# Altium project PCB_Project.PrjPcb
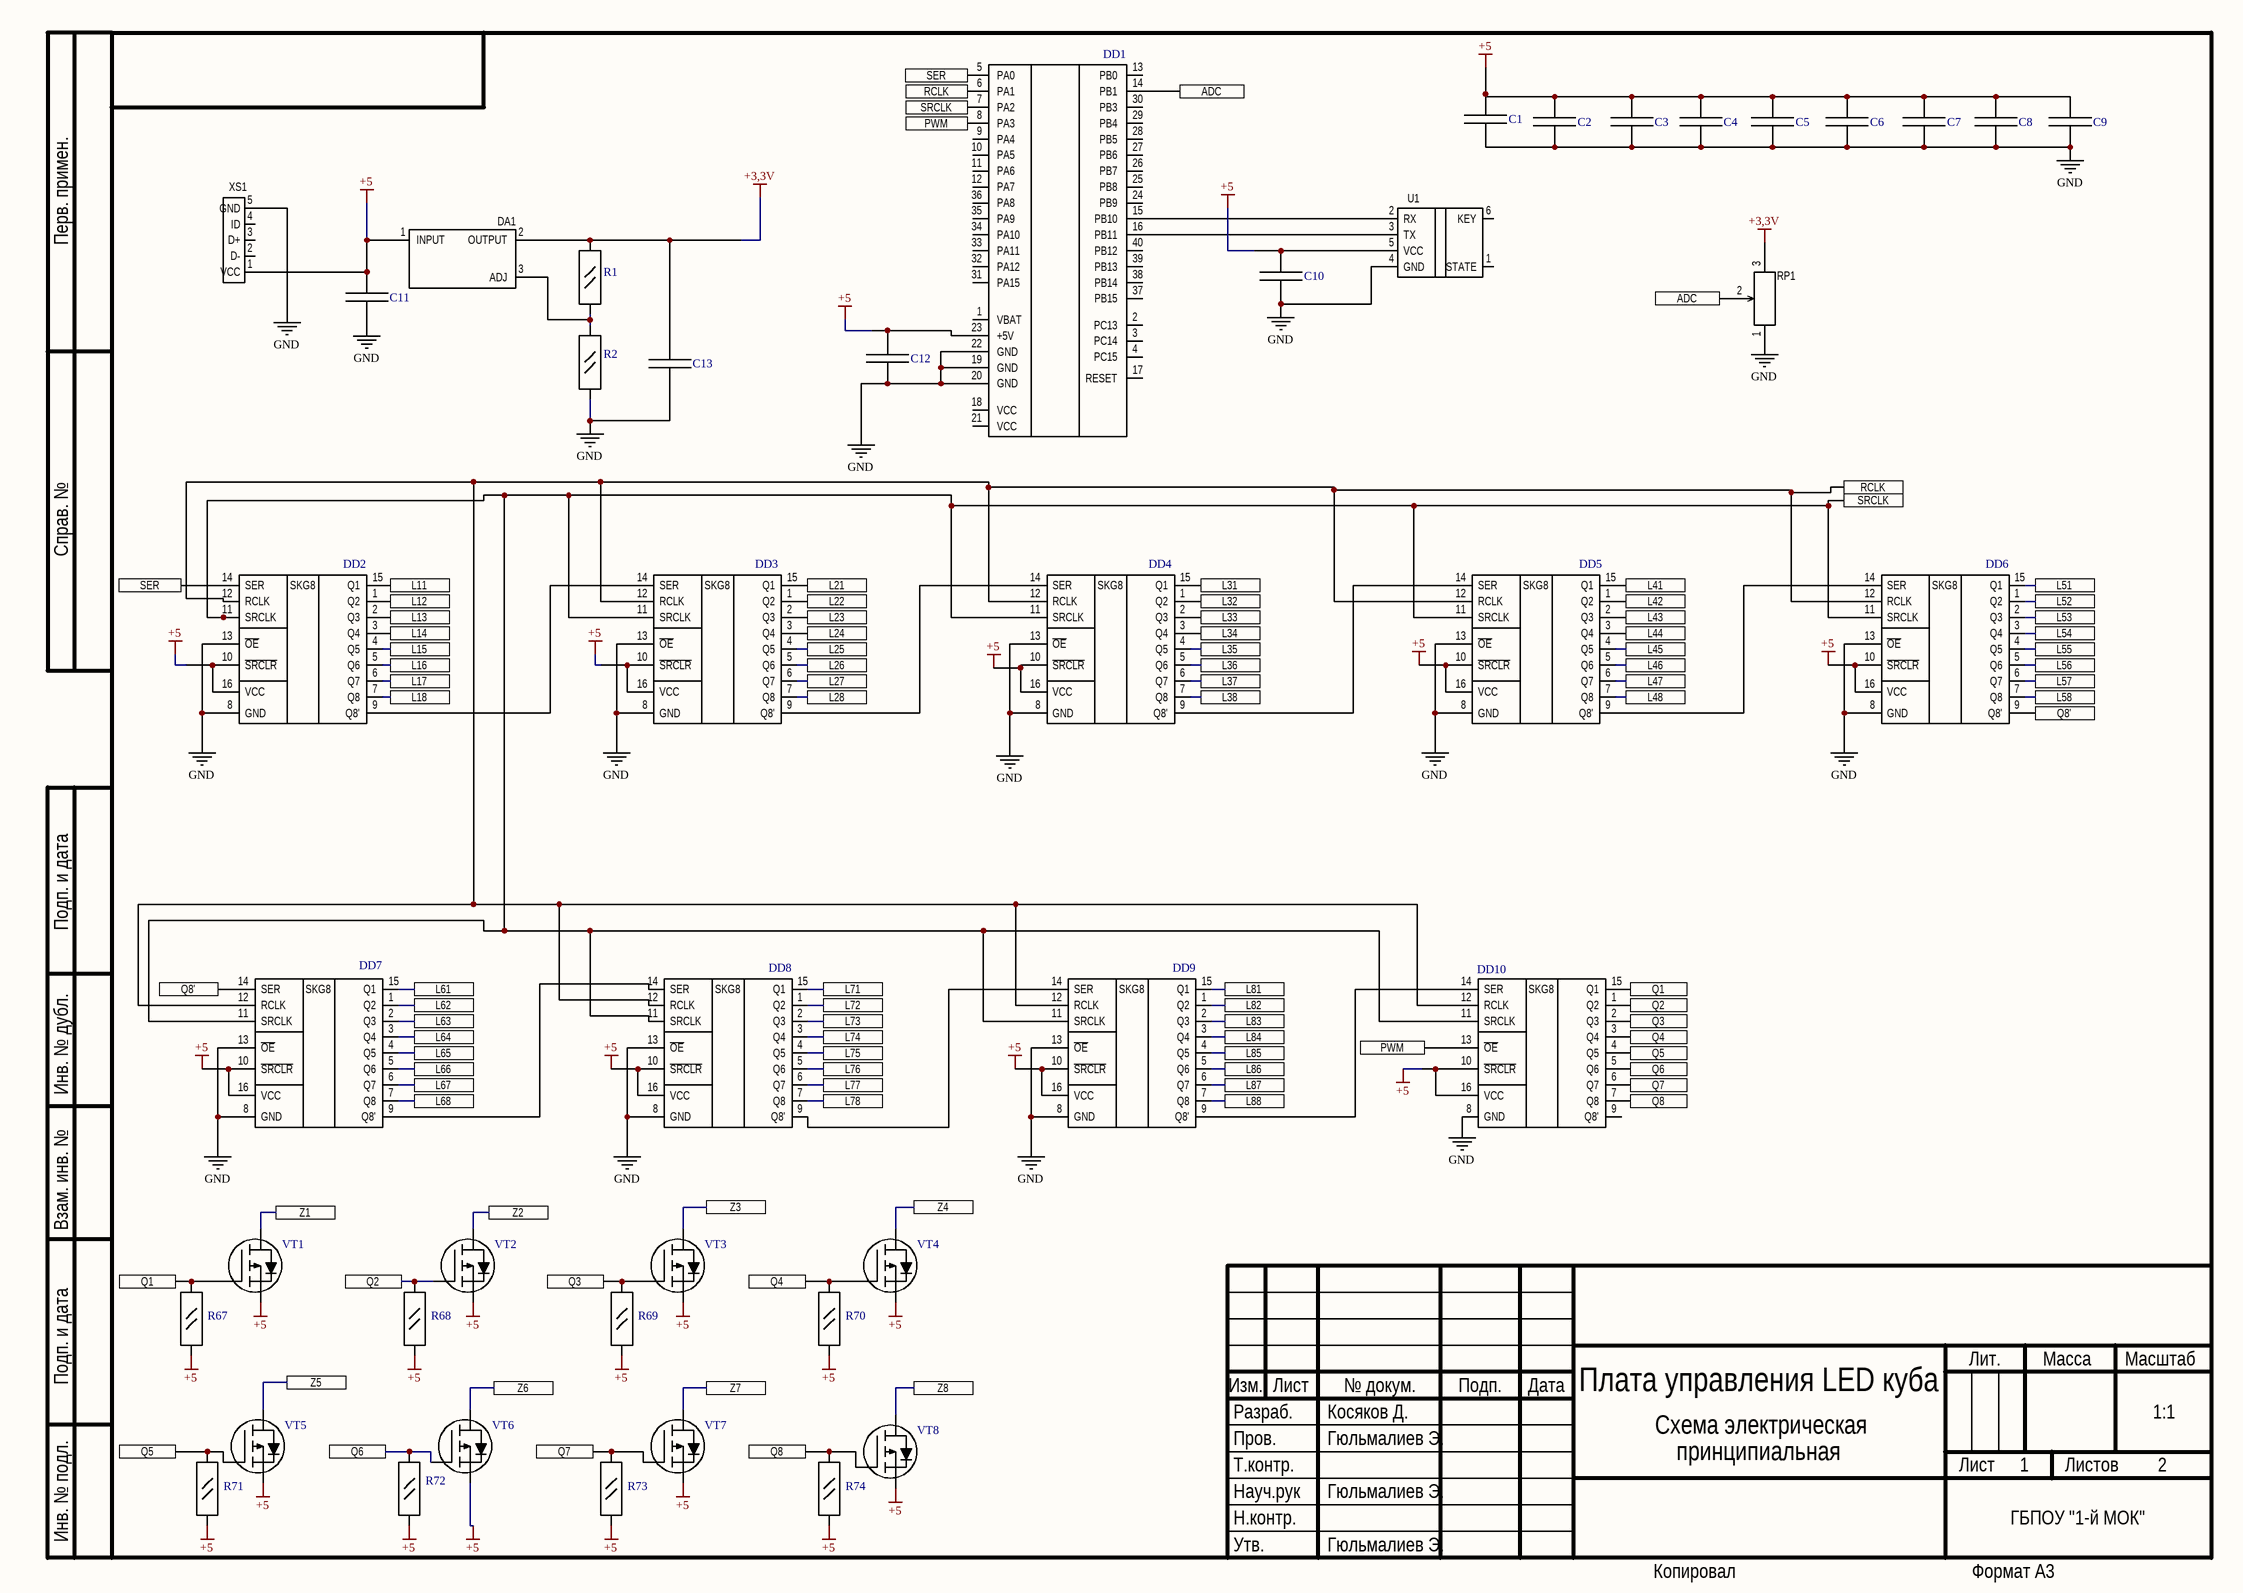
[diagram p0: Sheet1.SchDoc]
2 sheets, 109 parts. Net scope: flat (ports and power ports of the same name join across sheets).
Board file: PCB1.PcbDoc
Sheets:
  Sheet1.SchDoc
  Sheet2.SchDoc

## Sheet Sheet1.SchDoc
size 420 x 297 mm; Scale: 1:1; Разраб.: Косяков Д.; Пров.: Гюльмалиев Э.; Утв.: Гюльмалиев Э.; Номер листа: 1; Общее количество листов: 2; Масштаб: 1:1; Наименование организации: ГБПОУ "1-й МОК"; Наименование изделия 1: Плата управления LED куба; Наименование изделия 2: Схема электрическая; Наименование изделия 3: принципиальная; Нач. отд.: Науч.рук; Фамилия нач. отд.: Гюльмалиев Э.; SheetNumber: 1; SheetTotal: 2

### Parts
C1  0.1uF  [CAPC2112X13N]  (value not drawn)
C2  0.1uF  [CAPC2112X13N]  (value not drawn)
C3  0.1uF  [CAPC2112X13N]  (value not drawn)
C4  0.1uF  [CAPC2112X13N]  (value not drawn)
C5  0.1uF  [CAPC2112X13N]  (value not drawn)
C6  0.1uF  [CAPC2112X13N]  (value not drawn)
C7  0.1uF  [CAPC2112X13N]  (value not drawn)
C8  0.1uF  [CAPC2112X13N]  (value not drawn)
C9  0.1uF  [CAPC2112X13N]  (value not drawn)
C10  0.1uF  [CAPC2112X13N]  (value not drawn)
C11  0.1uF  [CAPC2112X13N]  (value not drawn)
C12  0.1uF  [CAPC2112X13N]  (value not drawn)
C13  1u.F  [CAPC2112X13N]  (value not drawn)
DA1  LM317  [SOT230P700X180-4N]  (value not drawn)
DD1  STM32F103C8T6  [stm32f103]  (value not drawn)
DD2  74HC595  [SOIC127P600X175-16N]  (value not drawn)
DD3  74HC595  [SOIC127P600X175-16N]  (value not drawn)
DD4  74HC595  [SOIC127P600X175-16N]  (value not drawn)
DD5  74HC595  [SOIC127P600X175-16N]  (value not drawn)
DD6  74HC595  [SOIC127P600X175-16N]  (value not drawn)
DD7  74HC595  [SOIC127P600X175-16N]  (value not drawn)
DD8  74HC595  [SOIC127P600X175-16N]  (value not drawn)
DD9  74HC595  [SOIC127P600X175-16N]  (value not drawn)
DD10  74HC595  [SOIC127P600X175-16N]  (value not drawn)
R1  240Ом  [RESC2113X06N]  (value not drawn)
R2  390 Ом  [RESC2113X06N]  (value not drawn)
R67  10k  [RESC2113X06N]  (value not drawn)
R68  10k  [RESC2113X06N]  (value not drawn)
R69  10k  [RESC2113X06N]  (value not drawn)
R70  10k  [RESC2113X06N]  (value not drawn)
R71  10k  [RESC2113X06N]  (value not drawn)
R72  10k  [RESC2113X06N]  (value not drawn)
R73  10k  [RESC2113X06N]  (value not drawn)
R74  10k  [RESC2113X06N]  (value not drawn)
RP1  Potent  [Potent1]  (value not drawn)
U1  HC-05  [HC-05]  (value not drawn)
VT1  P-channel  [SOT95P245X120-3N]  (value not drawn)
VT2  P-channel  [SOT95P245X120-3N]  (value not drawn)
VT3  P-channel  [SOT95P245X120-3N]  (value not drawn)
VT4  P-channel  [SOT95P245X120-3N]  (value not drawn)
VT5  P-channel  [SOT95P245X120-3N]  (value not drawn)
VT6  P-channel  [SOT95P245X120-3N]  (value not drawn)
VT7  P-channel  [SOT95P245X120-3N]  (value not drawn)
VT8  P-channel  [SOT95P245X120-3N]  (value not drawn)
XS1  USB  [USB]  (value not drawn)

### Ports
ADC, L11, L12, L13, L14, L15, L16, L17, L18, L21, L22, L23, L24, L25, L26, L27, L28, L31, L32, L33, L34, L35, L36, L37, L38, L41, L42, L43, L44, L45, L46, L47, L48, L51, L52, L53, L54, L55, L56, L57, L58, L61, L62, L63, L64, L65, L66, L67, L68, L71, L72, L73, L74, L75, L76, L77, L78, L81, L82, L83, L84, L85, L86, L87, L88, PWM, Q1, Q2, Q3, Q4, Q5, Q6, Q7, Q8, Q8', RCLK, SER, SRCLK, Z1, Z2, Z3, Z4, Z5, Z6, Z7, Z8

### Nets
+3,3V: C13.2 DA1.2(OUTPUT) R1.1 RP1.3
+5: C1.2 C2.2 C3.2 C4.2 C5.2 C6.2 C7.2 C8.2 C9.2 C10.2 C11.2 C12.2 DA1.1(INPUT) DD1.23(+5V) DD2.10(~{SRCLR}) DD2.16(VCC) DD3.10(~{SRCLR}) DD3.16(VCC) DD4.10(~{SRCLR}) DD4.16(VCC) DD5.10(~{SRCLR}) DD5.16(VCC) DD6.10(~{SRCLR}) DD6.16(VCC) DD7.10(~{SRCLR}) DD7.16(VCC) DD8.10(~{SRCLR}) DD8.16(VCC) DD9.10(~{SRCLR}) DD9.16(VCC) DD10.10(~{SRCLR}) DD10.16(VCC) R67.1 R68.1 R69.1 R70.1 R71.1 R72.1 R73.1 R74.1 U1.5(VCC) VT1.2 VT2.2 VT3.2 VT4.2 VT5.2 VT6.2 VT7.2 VT8.2 XS1.1(VCC)
GND: C1.1 C2.1 C3.1 C4.1 C5.1 C6.1 C7.1 C8.1 C9.1 C10.1 C11.1 C12.1 C13.1 DD1.19(GND) DD1.20(GND) DD1.22(GND) DD2.8(GND) DD2.13(~{OE}) DD3.8(GND) DD3.13(~{OE}) DD4.8(GND) DD4.13(~{OE}) DD5.8(GND) DD5.13(~{OE}) DD6.8(GND) DD6.13(~{OE}) DD7.8(GND) DD7.13(~{OE}) DD8.8(GND) DD8.13(~{OE}) DD9.8(GND) DD9.13(~{OE}) DD10.8(GND) R2.1 RP1.1 U1.4(GND) XS1.5(GND)
NetDA1_3: DA1.3(ADJ) R1.2 R2.2
NetDD1_5: DD1.5(PA0) DD2.14(SER) ; port SER
NetDD1_6: DD1.6(PA1) DD2.12(RCLK) DD3.12(RCLK) DD4.12(RCLK) DD5.12(RCLK) DD6.12(RCLK) DD7.12(RCLK) DD8.12(RCLK) DD9.12(RCLK) DD10.12(RCLK) ; port RCLK
NetDD1_7: DD1.7(PA2) DD2.11(SRCLK) DD3.11(SRCLK) DD4.11(SRCLK) DD5.11(SRCLK) DD6.11(SRCLK) DD7.11(SRCLK) DD8.11(SRCLK) DD9.11(SRCLK) DD10.11(SRCLK) ; port SRCLK
NetDD1_8: DD1.8(PA3) DD10.13(~{OE}) ; port PWM
NetDD1_14: DD1.14(PB1) RP1.2 ; port ADC
NetDD1_15: DD1.15(PB10) U1.2(RX)
NetDD1_16: DD1.16(PB11) U1.3(TX)
NetDD2_1: DD2.1(Q2) ; port L12
NetDD2_2: DD2.2(Q3) ; port L13
NetDD2_3: DD2.3(Q4) ; port L14
NetDD2_4: DD2.4(Q5) ; port L15
NetDD2_5: DD2.5(Q6) ; port L16
NetDD2_6: DD2.6(Q7) ; port L17
NetDD2_7: DD2.7(Q8) ; port L18
NetDD2_9: DD2.9(Q8') DD3.14(SER)
NetDD2_15: DD2.15(Q1) ; port L11
NetDD3_1: DD3.1(Q2) ; port L22
NetDD3_2: DD3.2(Q3) ; port L23
NetDD3_3: DD3.3(Q4) ; port L24
NetDD3_4: DD3.4(Q5) ; port L25
NetDD3_5: DD3.5(Q6) ; port L26
NetDD3_6: DD3.6(Q7) ; port L27
NetDD3_7: DD3.7(Q8) ; port L28
NetDD3_9: DD3.9(Q8') DD4.14(SER)
NetDD3_15: DD3.15(Q1) ; port L21
NetDD4_1: DD4.1(Q2) ; port L32
NetDD4_2: DD4.2(Q3) ; port L33
NetDD4_3: DD4.3(Q4) ; port L34
NetDD4_4: DD4.4(Q5) ; port L35
NetDD4_5: DD4.5(Q6) ; port L36
NetDD4_6: DD4.6(Q7) ; port L37
NetDD4_7: DD4.7(Q8) ; port L38
NetDD4_9: DD4.9(Q8') DD5.14(SER)
NetDD4_15: DD4.15(Q1) ; port L31
NetDD5_1: DD5.1(Q2) ; port L42
NetDD5_2: DD5.2(Q3) ; port L43
NetDD5_3: DD5.3(Q4) ; port L44
NetDD5_4: DD5.4(Q5) ; port L45
NetDD5_5: DD5.5(Q6) ; port L46
NetDD5_6: DD5.6(Q7) ; port L47
NetDD5_7: DD5.7(Q8) ; port L48
NetDD5_9: DD5.9(Q8') DD6.14(SER)
NetDD5_15: DD5.15(Q1) ; port L41
NetDD6_1: DD6.1(Q2) ; port L52
NetDD6_2: DD6.2(Q3) ; port L53
NetDD6_3: DD6.3(Q4) ; port L54
NetDD6_4: DD6.4(Q5) ; port L55
NetDD6_5: DD6.5(Q6) ; port L56
NetDD6_6: DD6.6(Q7) ; port L57
NetDD6_7: DD6.7(Q8) ; port L58
NetDD6_9: DD6.9(Q8') DD7.14(SER) ; port Q8'
NetDD6_15: DD6.15(Q1) ; port L51
NetDD7_1: DD7.1(Q2) ; port L62
NetDD7_2: DD7.2(Q3) ; port L63
NetDD7_3: DD7.3(Q4) ; port L64
NetDD7_4: DD7.4(Q5) ; port L65
NetDD7_5: DD7.5(Q6) ; port L66
NetDD7_6: DD7.6(Q7) ; port L67
NetDD7_7: DD7.7(Q8) ; port L68
NetDD7_9: DD7.9(Q8') DD8.14(SER)
NetDD7_15: DD7.15(Q1) ; port L61
NetDD8_1: DD8.1(Q2) ; port L72
NetDD8_2: DD8.2(Q3) ; port L73
NetDD8_3: DD8.3(Q4) ; port L74
NetDD8_4: DD8.4(Q5) ; port L75
NetDD8_5: DD8.5(Q6) ; port L76
NetDD8_6: DD8.6(Q7) ; port L77
NetDD8_7: DD8.7(Q8) ; port L78
NetDD8_9: DD8.9(Q8') DD9.14(SER)
NetDD8_15: DD8.15(Q1) ; port L71
NetDD9_1: DD9.1(Q2) ; port L82
NetDD9_2: DD9.2(Q3) ; port L83
NetDD9_3: DD9.3(Q4) ; port L84
NetDD9_4: DD9.4(Q5) ; port L85
NetDD9_5: DD9.5(Q6) ; port L86
NetDD9_6: DD9.6(Q7) ; port L87
NetDD9_7: DD9.7(Q8) ; port L88
NetDD9_9: DD9.9(Q8') DD10.14(SER)
NetDD9_15: DD9.15(Q1) ; port L81
NetDD10_1: DD10.1(Q2) R68.2 VT2.1 ; port Q2
NetDD10_2: DD10.2(Q3) R69.2 VT3.1 ; port Q3
NetDD10_3: DD10.3(Q4) R70.2 VT4.1 ; port Q4
NetDD10_4: DD10.4(Q5) R71.2 VT5.1 ; port Q5
NetDD10_5: DD10.5(Q6) R72.2 VT6.1 ; port Q6
NetDD10_6: DD10.6(Q7) R73.2 VT7.1 ; port Q7
NetDD10_7: DD10.7(Q8) R74.2 VT8.1 ; port Q8
NetDD10_15: DD10.15(Q1) R67.2 VT1.1 ; port Q1
NetVT1_3: VT1.3 ; port Z1
NetVT2_3: VT2.3 ; port Z2
NetVT3_3: VT3.3 ; port Z3
NetVT4_3: VT4.3 ; port Z4
NetVT5_3: VT5.3 ; port Z5
NetVT6_3: VT6.3 ; port Z6
NetVT7_3: VT7.3 ; port Z7
NetVT8_3: VT8.3 ; port Z8

Not connected (* = marked no-connect by the designer): DD1 1(VBAT) 2(PC13) 3(PC14) 4(PC15) 9(PA4) 10(PA5) 11(PA6) 12(PA7) 13(PB0) 17(RESET) 18(VCC) 21(VCC) 24(PB9) 25(PB8) 26(PB7) 27(PB6) 28(PB5) 29(PB4) 30(PB3) 31(PA15) 32(PA12) 33(PA11) 34(PA10) 35(PA9) 36(PA8) 37(PB15) 38(PB14) 39(PB13) 40(PB12); DD10 9(Q8'); U1 1(STATE) 6(KEY); XS1 2(D-) 3(D+) 4(ID)

### Notes on the sheet
- Перв. примен.
- Справ. №
- Подп. и дата
- Инв. № дубл.
- Взам. инв. №
- Разраб.
- Изм.
- Лист
- № докум.
- Подп.
- Дата
- Лит.
- Масса
- Масштаб
- Пров.
- Т.контр.
- Листов
- Инв. № подл.
- Утв.
- Н.контр.
- Копировал
- Формат А3
- (in symbol 74HC595) SKG8

### Library data of the parts
DA1 = LM317: Регулируемый стабилизатор напряжения
DD2-DD10 = 74HC595: Сдвиговый регистр
R67-R74 = Резистор 0805
RP1 = Potent: Переменный резистор 10кОм
VT1-VT8 = P-channel: Транзистор MOSFET N-канальный

## Sheet Sheet2.SchDoc
size 209 x 297 mm; Scale: 1:1; Номер листа: 2; Общее количество листов: 2; Разраб.: Косяков Д.; Пров.: Гюльмалиев Э.; Утв.: Гюльмалиев Э.; Масштаб: 1:1; Наименование изделия 1: Плата управления LED куба; Наименование изделия 2: Схема электрическая; Наименование изделия 3: принципиальная; Нач. отд.: Науч.рук.; Фамилия нач. отд.: Гюльмалиев Э.
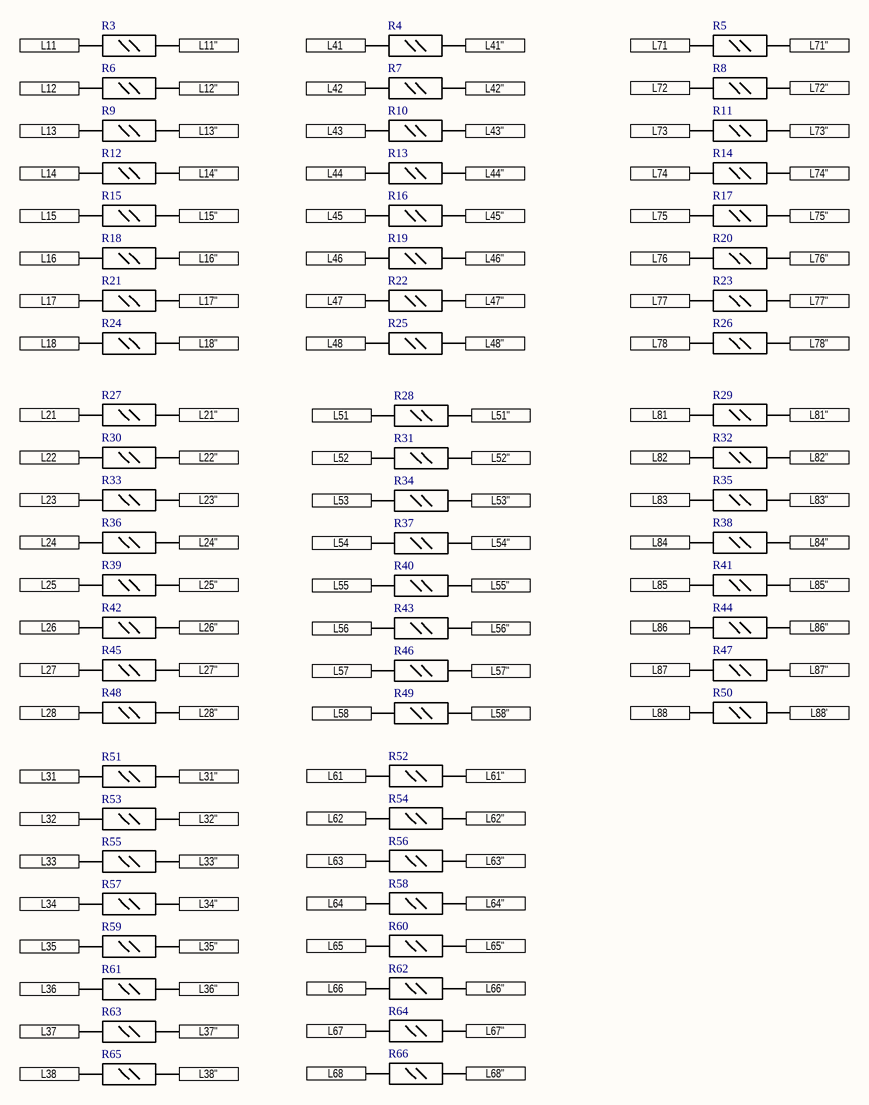
[diagram p1: Sheet2.SchDoc]

### Parts
R3  Резистор 0805  [RESC2113X06N]  (value not drawn)
R4  Резистор 0805  [RESC2113X06N]  (value not drawn)
R5  Резистор 0805  [RESC2113X06N]  (value not drawn)
R6  Резистор 0805  [RESC2113X06N]  (value not drawn)
R7  Резистор 0805  [RESC2113X06N]  (value not drawn)
R8  Резистор 0805  [RESC2113X06N]  (value not drawn)
R9  Резистор 0805  [RESC2113X06N]  (value not drawn)
R10  Резистор 0805  [RESC2113X06N]  (value not drawn)
R11  Резистор 0805  [RESC2113X06N]  (value not drawn)
R12  Резистор 0805  [RESC2113X06N]  (value not drawn)
R13  Резистор 0805  [RESC2113X06N]  (value not drawn)
R14  Резистор 0805  [RESC2113X06N]  (value not drawn)
R15  Резистор 0805  [RESC2113X06N]  (value not drawn)
R16  Резистор 0805  [RESC2113X06N]  (value not drawn)
R17  Резистор 0805  [RESC2113X06N]  (value not drawn)
R18  Резистор 0805  [RESC2113X06N]  (value not drawn)
R19  Резистор 0805  [RESC2113X06N]  (value not drawn)
R20  Резистор 0805  [RESC2113X06N]  (value not drawn)
R21  Резистор 0805  [RESC2113X06N]  (value not drawn)
R22  Резистор 0805  [RESC2113X06N]  (value not drawn)
R23  Резистор 0805  [RESC2113X06N]  (value not drawn)
R24  Резистор 0805  [RESC2113X06N]  (value not drawn)
R25  Резистор 0805  [RESC2113X06N]  (value not drawn)
R26  Резистор 0805  [RESC2113X06N]  (value not drawn)
R27  Резистор 0805  [RESC2113X06N]  (value not drawn)
R28  Резистор 0805  [RESC2113X06N]  (value not drawn)
R29  Резистор 0805  [RESC2113X06N]  (value not drawn)
R30  Резистор 0805  [RESC2113X06N]  (value not drawn)
R31  Резистор 0805  [RESC2113X06N]  (value not drawn)
R32  Резистор 0805  [RESC2113X06N]  (value not drawn)
R33  Резистор 0805  [RESC2113X06N]  (value not drawn)
R34  Резистор 0805  [RESC2113X06N]  (value not drawn)
R35  Резистор 0805  [RESC2113X06N]  (value not drawn)
R36  Резистор 0805  [RESC2113X06N]  (value not drawn)
R37  Резистор 0805  [RESC2113X06N]  (value not drawn)
R38  Резистор 0805  [RESC2113X06N]  (value not drawn)
R39  Резистор 0805  [RESC2113X06N]  (value not drawn)
R40  Резистор 0805  [RESC2113X06N]  (value not drawn)
R41  Резистор 0805  [RESC2113X06N]  (value not drawn)
R42  Резистор 0805  [RESC2113X06N]  (value not drawn)
R43  Резистор 0805  [RESC2113X06N]  (value not drawn)
R44  Резистор 0805  [RESC2113X06N]  (value not drawn)
R45  Резистор 0805  [RESC2113X06N]  (value not drawn)
R46  Резистор 0805  [RESC2113X06N]  (value not drawn)
R47  Резистор 0805  [RESC2113X06N]  (value not drawn)
R48  Резистор 0805  [RESC2113X06N]  (value not drawn)
R49  Резистор 0805  [RESC2113X06N]  (value not drawn)
R50  Резистор 0805  [RESC2113X06N]  (value not drawn)
R51  Резистор 0805  [RESC2113X06N]  (value not drawn)
R52  Резистор 0805  [RESC2113X06N]  (value not drawn)
R53  Резистор 0805  [RESC2113X06N]  (value not drawn)
R54  Резистор 0805  [RESC2113X06N]  (value not drawn)
R55  Резистор 0805  [RESC2113X06N]  (value not drawn)
R56  Резистор 0805  [RESC2113X06N]  (value not drawn)
R57  Резистор 0805  [RESC2113X06N]  (value not drawn)
R58  Резистор 0805  [RESC2113X06N]  (value not drawn)
R59  Резистор 0805  [RESC2113X06N]  (value not drawn)
R60  Резистор 0805  [RESC2113X06N]  (value not drawn)
R61  Резистор 0805  [RESC2113X06N]  (value not drawn)
R62  Резистор 0805  [RESC2113X06N]  (value not drawn)
R63  Резистор 0805  [RESC2113X06N]  (value not drawn)
R64  Резистор 0805  [RESC2113X06N]  (value not drawn)
R65  Резистор 0805  [RESC2113X06N]  (value not drawn)
R66  Резистор 0805  [RESC2113X06N]  (value not drawn)

### Ports
L11, L11", L12, L12", L13, L13", L14, L14", L15, L15", L16, L16", L17, L17", L18, L18", L21, L21", L22, L22", L23, L23", L24, L24", L25, L25", L26, L26", L27, L27", L28, L28", L31, L31", L32, L32", L33, L33", L34, L34", L35, L35", L36, L36", L37, L37", L38, L38", L41, L41", L42, L42", L43, L43", L44, L44", L45, L45", L46, L46", L47, L47", L48, L48", L51, L51", L52, L52", L53, L53", L54, L54", L55, L55", L56, L56", L57, L57", L58, L58", L61, L61", L62, L62", L63, L63", L64, L64", L65, L65", L66, L66", L67, L67", L68, L68", L71, L71", L72, L72", L73, L73", L74, L74", L75, L75", L76, L76", L77, L77", L78, L78", L81, L81", L82, L82", L83, L83", L84, L84", L85, L85", L86, L86", L87, L87", L88, L88'

### Nets
NetDD2_1: R6.1 ; port L12
NetDD2_2: R9.1 ; port L13
NetDD2_3: R12.1 ; port L14
NetDD2_4: R15.1 ; port L15
NetDD2_5: R18.1 ; port L16
NetDD2_6: R21.1 ; port L17
NetDD2_7: R24.1 ; port L18
NetDD2_15: R3.1 ; port L11
NetDD3_1: R30.1 ; port L22
NetDD3_2: R33.1 ; port L23
NetDD3_3: R36.1 ; port L24
NetDD3_4: R39.1 ; port L25
NetDD3_5: R42.1 ; port L26
NetDD3_6: R45.1 ; port L27
NetDD3_7: R48.1 ; port L28
NetDD3_15: R27.1 ; port L21
NetDD4_1: R53.1 ; port L32
NetDD4_2: R55.1 ; port L33
NetDD4_3: R57.1 ; port L34
NetDD4_4: R59.1 ; port L35
NetDD4_5: R61.1 ; port L36
NetDD4_6: R63.1 ; port L37
NetDD4_7: R65.1 ; port L38
NetDD4_15: R51.1 ; port L31
NetDD5_1: R7.1 ; port L42
NetDD5_2: R10.1 ; port L43
NetDD5_3: R13.1 ; port L44
NetDD5_4: R16.1 ; port L45
NetDD5_5: R19.1 ; port L46
NetDD5_6: R22.1 ; port L47
NetDD5_7: R25.1 ; port L48
NetDD5_15: R4.1 ; port L41
NetDD6_1: R31.1 ; port L52
NetDD6_2: R34.1 ; port L53
NetDD6_3: R37.1 ; port L54
NetDD6_4: R40.1 ; port L55
NetDD6_5: R43.1 ; port L56
NetDD6_6: R46.1 ; port L57
NetDD6_7: R49.1 ; port L58
NetDD6_15: R28.1 ; port L51
NetDD7_1: R54.1 ; port L62
NetDD7_2: R56.1 ; port L63
NetDD7_3: R58.1 ; port L64
NetDD7_4: R60.1 ; port L65
NetDD7_5: R62.1 ; port L66
NetDD7_6: R64.1 ; port L67
NetDD7_7: R66.1 ; port L68
NetDD7_15: R52.1 ; port L61
NetDD8_1: R8.1 ; port L72
NetDD8_2: R11.1 ; port L73
NetDD8_3: R14.1 ; port L74
NetDD8_4: R17.1 ; port L75
NetDD8_5: R20.1 ; port L76
NetDD8_6: R23.1 ; port L77
NetDD8_7: R26.1 ; port L78
NetDD8_15: R5.1 ; port L71
NetDD9_1: R32.1 ; port L82
NetDD9_2: R35.1 ; port L83
NetDD9_3: R38.1 ; port L84
NetDD9_4: R41.1 ; port L85
NetDD9_5: R44.1 ; port L86
NetDD9_6: R47.1 ; port L87
NetDD9_7: R50.1 ; port L88
NetDD9_15: R29.1 ; port L81
NetR3_2: R3.2 ; port L11"
NetR4_2: R4.2 ; port L41"
NetR5_2: R5.2 ; port L71"
NetR6_2: R6.2 ; port L12"
NetR7_2: R7.2 ; port L42"
NetR8_2: R8.2 ; port L72"
NetR9_2: R9.2 ; port L13"
NetR10_2: R10.2 ; port L43"
NetR11_2: R11.2 ; port L73"
NetR12_2: R12.2 ; port L14"
NetR13_2: R13.2 ; port L44"
NetR14_2: R14.2 ; port L74"
NetR15_2: R15.2 ; port L15"
NetR16_2: R16.2 ; port L45"
NetR17_2: R17.2 ; port L75"
NetR18_2: R18.2 ; port L16"
NetR19_2: R19.2 ; port L46"
NetR20_2: R20.2 ; port L76"
NetR21_2: R21.2 ; port L17"
NetR22_2: R22.2 ; port L47"
NetR23_2: R23.2 ; port L77"
NetR24_2: R24.2 ; port L18"
NetR25_2: R25.2 ; port L48"
NetR26_2: R26.2 ; port L78"
NetR27_2: R27.2 ; port L21"
NetR28_2: R28.2 ; port L51"
NetR29_2: R29.2 ; port L81"
NetR30_2: R30.2 ; port L22"
NetR31_2: R31.2 ; port L52"
NetR32_2: R32.2 ; port L82"
NetR33_2: R33.2 ; port L23"
NetR34_2: R34.2 ; port L53"
NetR35_2: R35.2 ; port L83"
NetR36_2: R36.2 ; port L24"
NetR37_2: R37.2 ; port L54"
NetR38_2: R38.2 ; port L84"
NetR39_2: R39.2 ; port L25"
NetR40_2: R40.2 ; port L55"
NetR41_2: R41.2 ; port L85"
NetR42_2: R42.2 ; port L26"
NetR43_2: R43.2 ; port L56"
NetR44_2: R44.2 ; port L86"
NetR45_2: R45.2 ; port L27"
NetR46_2: R46.2 ; port L57"
NetR47_2: R47.2 ; port L87"
NetR48_2: R48.2 ; port L28"
NetR49_2: R49.2 ; port L58"
NetR50_2: R50.2 ; port L88'
NetR51_2: R51.2 ; port L31"
NetR52_2: R52.2 ; port L61"
NetR53_2: R53.2 ; port L32"
NetR54_2: R54.2 ; port L62"
NetR55_2: R55.2 ; port L33"
NetR56_2: R56.2 ; port L63"
NetR57_2: R57.2 ; port L34"
NetR58_2: R58.2 ; port L64"
NetR59_2: R59.2 ; port L35"
NetR60_2: R60.2 ; port L65"
NetR61_2: R61.2 ; port L36"
NetR62_2: R62.2 ; port L66"
NetR63_2: R63.2 ; port L37"
NetR64_2: R64.2 ; port L67"
NetR65_2: R65.2 ; port L38"
NetR66_2: R66.2 ; port L68"

### Notes on the sheet
- Перв. примен.
- Справ. №
- Подп. и дата
- Инв. № дубл.
- Взам. инв. №
- Разраб.
- Изм.
- Лист
- № докум.
- Подп.
- Дата
- Лит.
- Масса
- Масштаб
- Пров.
- Т.контр.
- Листов
- Инв. № подл.
- Утв.
- Н.контр.
- Копировал
- Формат А4

## Nets that join several sheets
NetDD2_1: Sheet1 (DD2.1), Sheet2 (R6.1)
NetDD2_2: Sheet1 (DD2.2), Sheet2 (R9.1)
NetDD2_3: Sheet1 (DD2.3), Sheet2 (R12.1)
NetDD2_4: Sheet1 (DD2.4), Sheet2 (R15.1)
NetDD2_5: Sheet1 (DD2.5), Sheet2 (R18.1)
NetDD2_6: Sheet1 (DD2.6), Sheet2 (R21.1)
NetDD2_7: Sheet1 (DD2.7), Sheet2 (R24.1)
NetDD2_15: Sheet1 (DD2.15), Sheet2 (R3.1)
NetDD3_1: Sheet1 (DD3.1), Sheet2 (R30.1)
NetDD3_2: Sheet1 (DD3.2), Sheet2 (R33.1)
NetDD3_3: Sheet1 (DD3.3), Sheet2 (R36.1)
NetDD3_4: Sheet1 (DD3.4), Sheet2 (R39.1)
NetDD3_5: Sheet1 (DD3.5), Sheet2 (R42.1)
NetDD3_6: Sheet1 (DD3.6), Sheet2 (R45.1)
NetDD3_7: Sheet1 (DD3.7), Sheet2 (R48.1)
NetDD3_15: Sheet1 (DD3.15), Sheet2 (R27.1)
NetDD4_1: Sheet1 (DD4.1), Sheet2 (R53.1)
NetDD4_2: Sheet1 (DD4.2), Sheet2 (R55.1)
NetDD4_3: Sheet1 (DD4.3), Sheet2 (R57.1)
NetDD4_4: Sheet1 (DD4.4), Sheet2 (R59.1)
NetDD4_5: Sheet1 (DD4.5), Sheet2 (R61.1)
NetDD4_6: Sheet1 (DD4.6), Sheet2 (R63.1)
NetDD4_7: Sheet1 (DD4.7), Sheet2 (R65.1)
NetDD4_15: Sheet1 (DD4.15), Sheet2 (R51.1)
NetDD5_1: Sheet1 (DD5.1), Sheet2 (R7.1)
NetDD5_2: Sheet1 (DD5.2), Sheet2 (R10.1)
NetDD5_3: Sheet1 (DD5.3), Sheet2 (R13.1)
NetDD5_4: Sheet1 (DD5.4), Sheet2 (R16.1)
NetDD5_5: Sheet1 (DD5.5), Sheet2 (R19.1)
NetDD5_6: Sheet1 (DD5.6), Sheet2 (R22.1)
NetDD5_7: Sheet1 (DD5.7), Sheet2 (R25.1)
NetDD5_15: Sheet1 (DD5.15), Sheet2 (R4.1)
NetDD6_1: Sheet1 (DD6.1), Sheet2 (R31.1)
NetDD6_2: Sheet1 (DD6.2), Sheet2 (R34.1)
NetDD6_3: Sheet1 (DD6.3), Sheet2 (R37.1)
NetDD6_4: Sheet1 (DD6.4), Sheet2 (R40.1)
NetDD6_5: Sheet1 (DD6.5), Sheet2 (R43.1)
NetDD6_6: Sheet1 (DD6.6), Sheet2 (R46.1)
NetDD6_7: Sheet1 (DD6.7), Sheet2 (R49.1)
NetDD6_15: Sheet1 (DD6.15), Sheet2 (R28.1)
NetDD7_1: Sheet1 (DD7.1), Sheet2 (R54.1)
NetDD7_2: Sheet1 (DD7.2), Sheet2 (R56.1)
NetDD7_3: Sheet1 (DD7.3), Sheet2 (R58.1)
NetDD7_4: Sheet1 (DD7.4), Sheet2 (R60.1)
NetDD7_5: Sheet1 (DD7.5), Sheet2 (R62.1)
NetDD7_6: Sheet1 (DD7.6), Sheet2 (R64.1)
NetDD7_7: Sheet1 (DD7.7), Sheet2 (R66.1)
NetDD7_15: Sheet1 (DD7.15), Sheet2 (R52.1)
NetDD8_1: Sheet1 (DD8.1), Sheet2 (R8.1)
NetDD8_2: Sheet1 (DD8.2), Sheet2 (R11.1)
NetDD8_3: Sheet1 (DD8.3), Sheet2 (R14.1)
NetDD8_4: Sheet1 (DD8.4), Sheet2 (R17.1)
NetDD8_5: Sheet1 (DD8.5), Sheet2 (R20.1)
NetDD8_6: Sheet1 (DD8.6), Sheet2 (R23.1)
NetDD8_7: Sheet1 (DD8.7), Sheet2 (R26.1)
NetDD8_15: Sheet1 (DD8.15), Sheet2 (R5.1)
NetDD9_1: Sheet1 (DD9.1), Sheet2 (R32.1)
NetDD9_2: Sheet1 (DD9.2), Sheet2 (R35.1)
NetDD9_3: Sheet1 (DD9.3), Sheet2 (R38.1)
NetDD9_4: Sheet1 (DD9.4), Sheet2 (R41.1)
NetDD9_5: Sheet1 (DD9.5), Sheet2 (R44.1)
NetDD9_6: Sheet1 (DD9.6), Sheet2 (R47.1)
NetDD9_7: Sheet1 (DD9.7), Sheet2 (R50.1)
NetDD9_15: Sheet1 (DD9.15), Sheet2 (R29.1)